# EAGLE schematic elements_v02 (EAGLE 5.09)

## Sheet 1 of 5
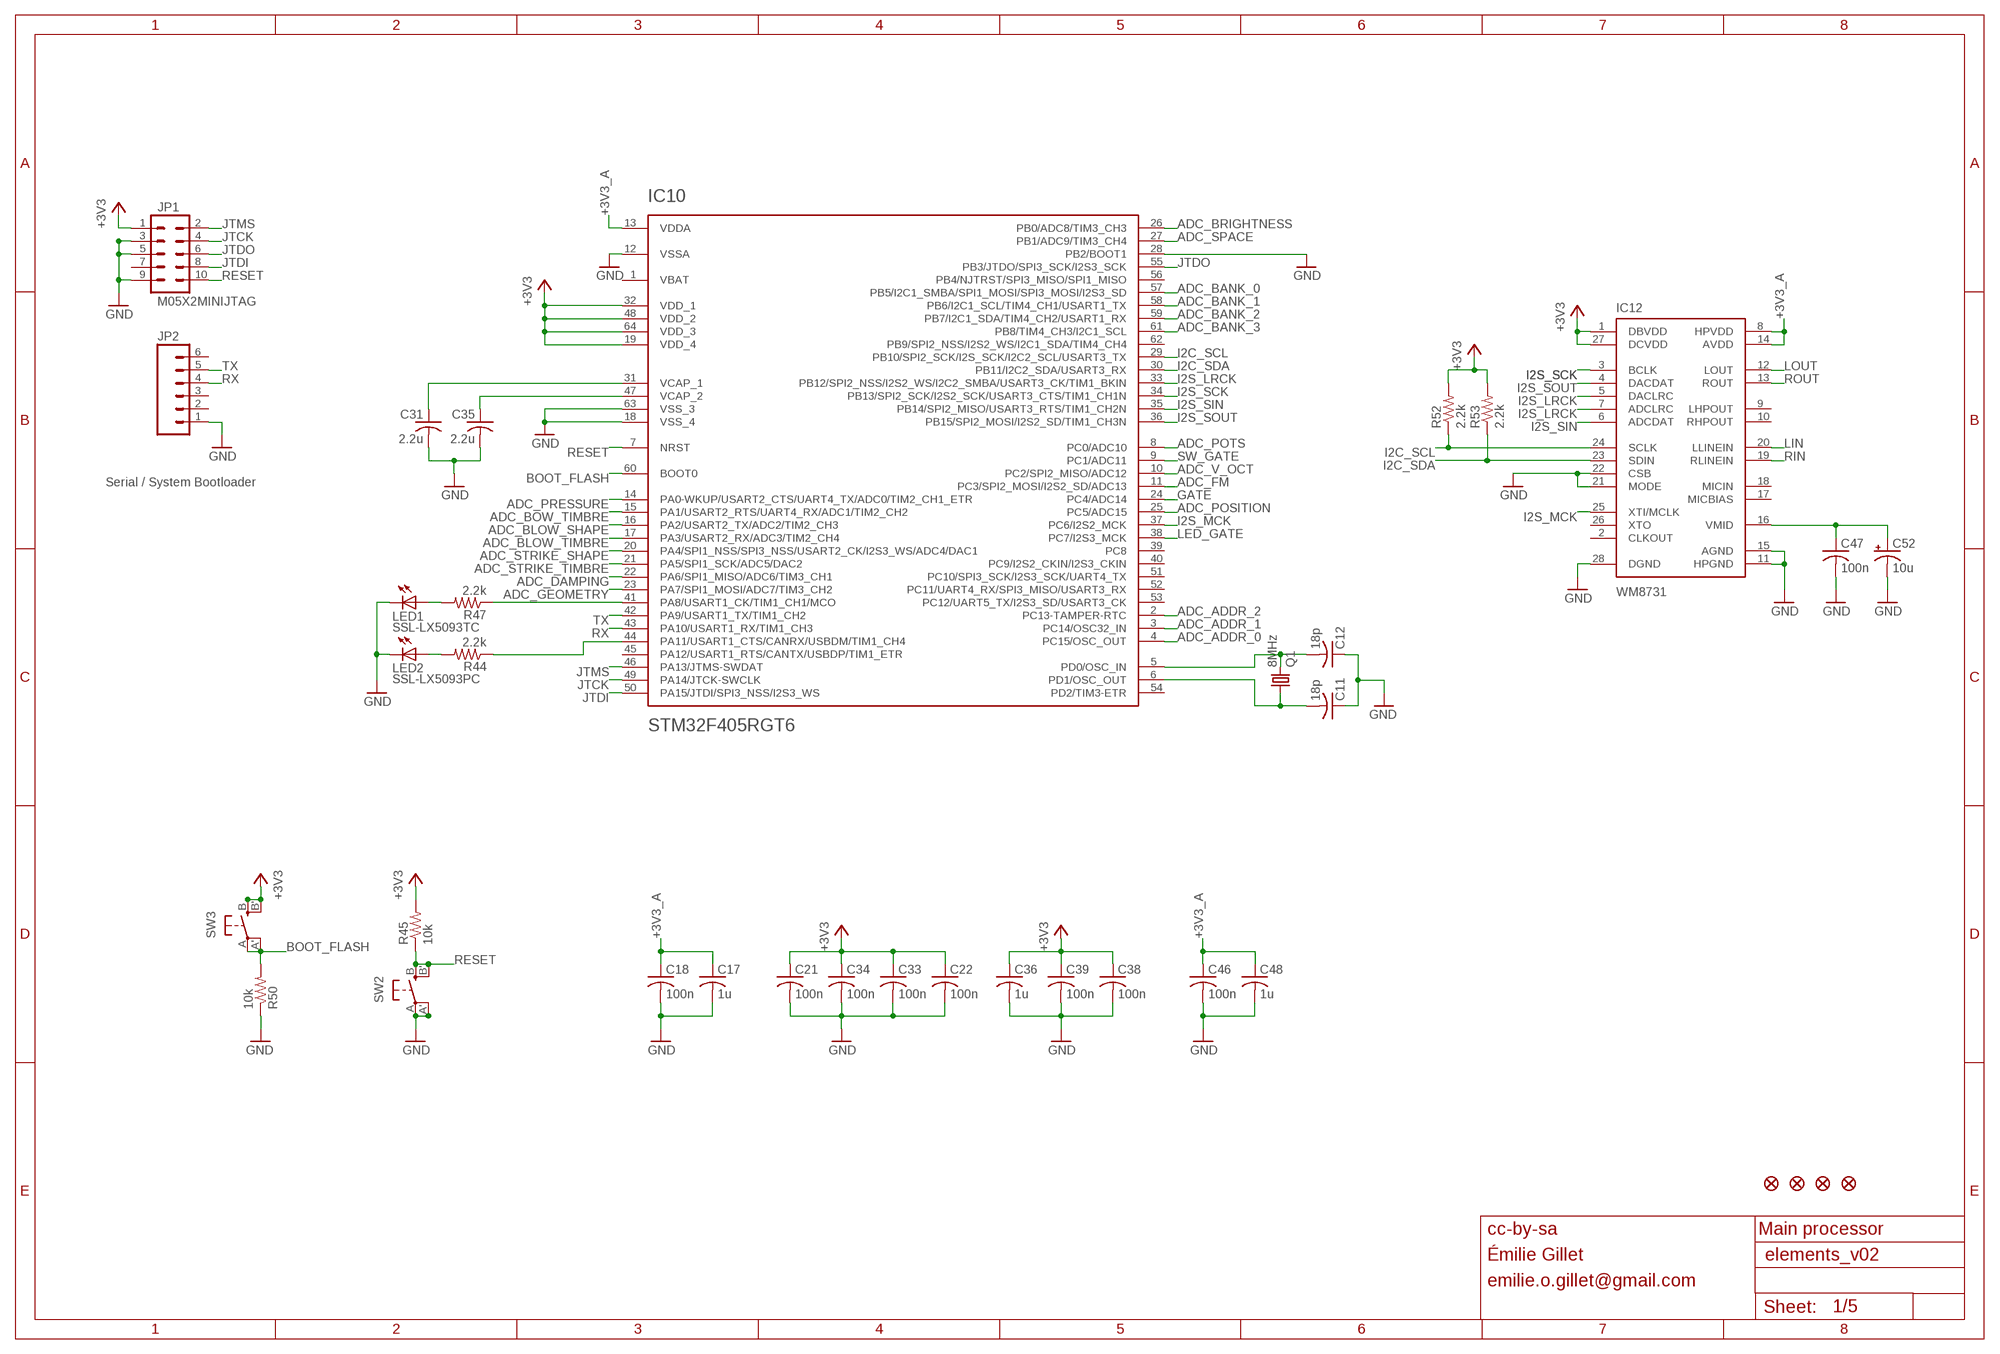
[diagram p0: schematic, sheet 1]

### Parts
C11  18p  C-USC0603  [C0603]
C12  18p  C-USC0603  [C0603]
C17  1u  C-USC0603  [C0603]
C18  100n  C-USC0603  [C0603]
C21  100n  C-USC0603  [C0603]
C22  100n  C-USC0603  [C0603]
C31  2.2u  C-USC0805  [C0805]
C33  100n  C-USC0603  [C0603]
C34  100n  C-USC0603  [C0603]
C35  2.2u  C-USC0805  [C0805]
C36  1u  C-USC0603  [C0603]
C38  100n  C-USC0603  [C0603]
C39  100n  C-USC0603  [C0603]
C46  100n  C-USC0603  [C0603]
C47  100n  C-USC0603  [C0603]
C48  1u  C-USC0603  [C0603]
C52  10u  CPOL-USB  [PANASONIC_B]
F1  FIDUCIAL1X2  [FIDUCIAL-1X2]
F2  FIDUCIAL1X2  [FIDUCIAL-1X2]
F3  FIDUCIAL1X2  [FIDUCIAL-1X2]
F4  FIDUCIAL1X2  [FIDUCIAL-1X2]
IC10  STM32F405RGT6  STM32F20X  [TQFP-10X10-64]
IC12  WM8731  [SSOP28]
JP1  M05X2MINIJTAG  [2X5-1.27]
JP2  M06SIP  [1X06]
LED1  SSL-LX5093TC  LED5MM  [LED5MM]
LED2  SSL-LX5093PC  LED5MM  [LED5MM]
Q1  8MHz  CRYSTALHC49UP  [HC49UP]
R44  2.2k  R-US_R0603  [R0603]
R45  10k  R-US_R0603  [R0603]
R47  2.2k  R-US_R0603  [R0603]
R50  10k  R-US_R0603  [R0603]
R52  2.2k  R-US_R0603  [R0603]
R53  2.2k  R-US_R0603  [R0603]
SW2  EVQQ2  [EVQ-Q2]
SW3  EVQQ2  [EVQ-Q2]

### Nets
+3V3: C21.1 C22.1 C33.1 C34.1 C36.1 C38.1 C39.1 IC10.19(VDD_4) IC10.32(VDD_1) IC10.48(VDD_2) IC10.64(VDD_3) IC12.1(DBVDD) IC12.27(DCVDD) JP1.1 R45.2 R52.2 R53.2 SW3.B'(S1) SW3.B(S) ; also sheet 5
+3V3_A: C17.1 C18.1 C46.1 C48.1 IC10.13(VDDA) IC12.8(HPVDD) IC12.14(AVDD) ; also sheet 3,4,5
ADC_ADDR_0: IC10.4(PC15/OSC_OUT) ; also sheet 4
ADC_ADDR_1: IC10.3(PC14/OSC32_IN) ; also sheet 4
ADC_ADDR_2: IC10.2(PC13-TAMPER-RTC) ; also sheet 4
ADC_BANK_0: IC10.57(PB5/I2C1_SMBA/SPI1_MOSI/SPI3_MOSI/I2S3_SD) ; also sheet 4
ADC_BANK_1: IC10.58(PB6/I2C1_SCL/TIM4_CH1/USART1_TX) ; also sheet 4
ADC_BANK_2: IC10.59(PB7/I2C1_SDA/TIM4_CH2/USART1_RX) ; also sheet 4
ADC_BANK_3: IC10.61(PB8/TIM4_CH3/I2C1_SCL) ; also sheet 4
ADC_BLOW_SHAPE: IC10.16(PA2/USART2_TX/ADC2/TIM2_CH3) ; also sheet 3
ADC_BLOW_TIMBRE: IC10.17(PA3/USART2_RX/ADC3/TIM2_CH4) ; also sheet 3
ADC_BOW_TIMBRE: IC10.15(PA1/USART2_RTS/UART4_RX/ADC1/TIM2_CH2) ; also sheet 3
ADC_BRIGHTNESS: IC10.26(PB0/ADC8/TIM3_CH3) ; also sheet 3
ADC_DAMPING: IC10.22(PA6/SPI1_MISO/ADC6/TIM3_CH1) ; also sheet 3
ADC_FM: IC10.11(PC3/SPI2_MOSI/I2S2_SD/ADC13) ; also sheet 3
ADC_GEOMETRY: IC10.23(PA7/SPI1_MOSI/ADC7/TIM3_CH2) ; also sheet 3
ADC_POSITION: IC10.25(PC5/ADC15) ; also sheet 3
ADC_POTS: IC10.8(PC0/ADC10) ; also sheet 4
ADC_PRESSURE: IC10.14(PA0-WKUP/USART2_CTS/UART4_TX/ADC0/TIM2_CH1_ETR) ; also sheet 3
ADC_SPACE: IC10.27(PB1/ADC9/TIM3_CH4) ; also sheet 3
ADC_STRIKE_SHAPE: IC10.20(PA4/SPI1_NSS/SPI3_NSS/USART2_CK/I2S3_WS/ADC4/DAC1) ; also sheet 3
ADC_STRIKE_TIMBRE: IC10.21(PA5/SPI1_SCK/ADC5/DAC2) ; also sheet 3
ADC_V_OCT: IC10.10(PC2/SPI2_MISO/ADC12) ; also sheet 3
BOOT_FLASH: IC10.60(BOOT0) R50.2 SW3.A'(P1) SW3.A(P)
GATE: IC10.24(PC4/ADC14) ; also sheet 4
GND: C11.1 C12.1 C17.2 C18.2 C21.2 C22.2 C31.2 C33.2 C34.2 C35.2 C36.2 C38.2 C39.2 C46.2 C47.2 C48.2 C52.- IC10.12(VSSA) IC10.18(VSS_4) IC10.28(PB2/BOOT1) IC10.63(VSS_3) IC12.11(HPGND) IC12.15(AGND) IC12.21(MODE) IC12.22(CSB) IC12.28(DGND) JP1.3 JP1.5 JP1.9 JP2.1 LED1.K(C) LED2.K(C) R50.1 SW2.A'(P1) SW2.A(P) ; also sheet 2,3,4,5
I2C_SCL: IC10.29(PB10/SPI2_SCK/I2S_SCK/I2C2_SCL/USART3_TX) IC12.24(SCLK) R52.1
I2C_SDA: IC10.30(PB11/I2C2_SDA/USART3_RX) IC12.23(SDIN) R53.1
I2S_LRCK: IC10.33(PB12/SPI2_NSS/I2S2_WS/I2C2_SMBA/USART3_CK/TIM1_BKIN) IC12.5(DACLRC) IC12.7(ADCLRC)
I2S_MCK: IC10.37(PC6/I2S2_MCK) IC12.25(XTI/MCLK)
I2S_SCK: IC10.34(PB13/SPI2_SCK/I2S2_SCK/USART3_CTS/TIM1_CH1N) IC12.3(BCLK)
I2S_SIN: IC10.35(PB14/SPI2_MISO/USART3_RTS/TIM1_CH2N) IC12.6(ADCDAT)
I2S_SOUT: IC10.36(PB15/SPI2_MOSI/I2S2_SD/TIM1_CH3N) IC12.4(DACDAT)
JTCK: IC10.49(PA14/JTCK-SWCLK) JP1.4
JTDI: IC10.50(PA15/JTDI/SPI3_NSS/I2S3_WS) JP1.8
JTDO: IC10.55(PB3/JTDO/SPI3_SCK/I2S3_SCK) JP1.6
JTMS: IC10.46(PA13/JTMS-SWDAT) JP1.2
LED_GATE: IC10.38(PC7/I2S3_MCK) ; also sheet 4
LIN: IC12.20(LLINEIN) ; also sheet 2
LOUT: IC12.12(LOUT) ; also sheet 2
N$7: C12.2 IC10.5(PD0/OSC_IN) Q1.2
N$8: C11.2 IC10.6(PD1/OSC_OUT) Q1.1
N$13: C35.1 IC10.47(VCAP_2)
N$17: C47.1 C52.+ IC12.16(VMID)
N$19: C31.1 IC10.31(VCAP_1)
N$54: IC10.44(PA11/USART1_CTS/CANRX/USBDM/TIM1_CH4) R44.1
N$59: LED2.A R44.2
N$60: LED1.A R47.2
N$79: IC10.41(PA8/USART1_CK/TIM1_CH1/MCO) R47.1
RESET: IC10.7(NRST) JP1.10 R45.1 SW2.B'(S1) SW2.B(S)
RIN: IC12.19(RLINEIN) ; also sheet 2
ROUT: IC12.13(ROUT) ; also sheet 2
RX: IC10.43(PA10/USART1_RX/TIM1_CH3) JP2.4
SW_GATE: IC10.9(PC1/ADC11) ; also sheet 4
TX: IC10.42(PA9/USART1_TX/TIM1_CH2) JP2.5
Unconnected: IC10.39(PC8) IC10.40(PC9/I2S2_CKIN/I2S3_CKIN) IC10.45(PA12/USART1_RTS/CANTX/USBDP/TIM1_ETR) IC10.51(PC10/SPI3_SCK/I2S3_SCK/UART4_TX) IC10.52(PC11/UART4_RX/SPI3_MISO/USART3_RX) IC10.53(PC12/UART5_TX/I2S3_SD/USART3_CK) IC10.54(PD2/TIM3-ETR) IC10.56(PB4/NJTRST/SPI3_MISO/SPI1_MISO) IC10.62(PB9/SPI2_NSS/I2S2_WS/I2C1_SDA/TIM4_CH4) IC12.2(CLKOUT) IC12.9(LHPOUT) IC12.10(RHPOUT) IC12.17(MICBIAS) IC12.18(MICIN) IC12.26(XTO) JP1.7 JP2.2 JP2.3 JP2.6

### Notes on the sheet
- Serial / System Bootloader
- cc-by-sa | Main processor
- Émilie Gillet
- emilie.o.gillet@gmail.com

## Sheet 2 of 5
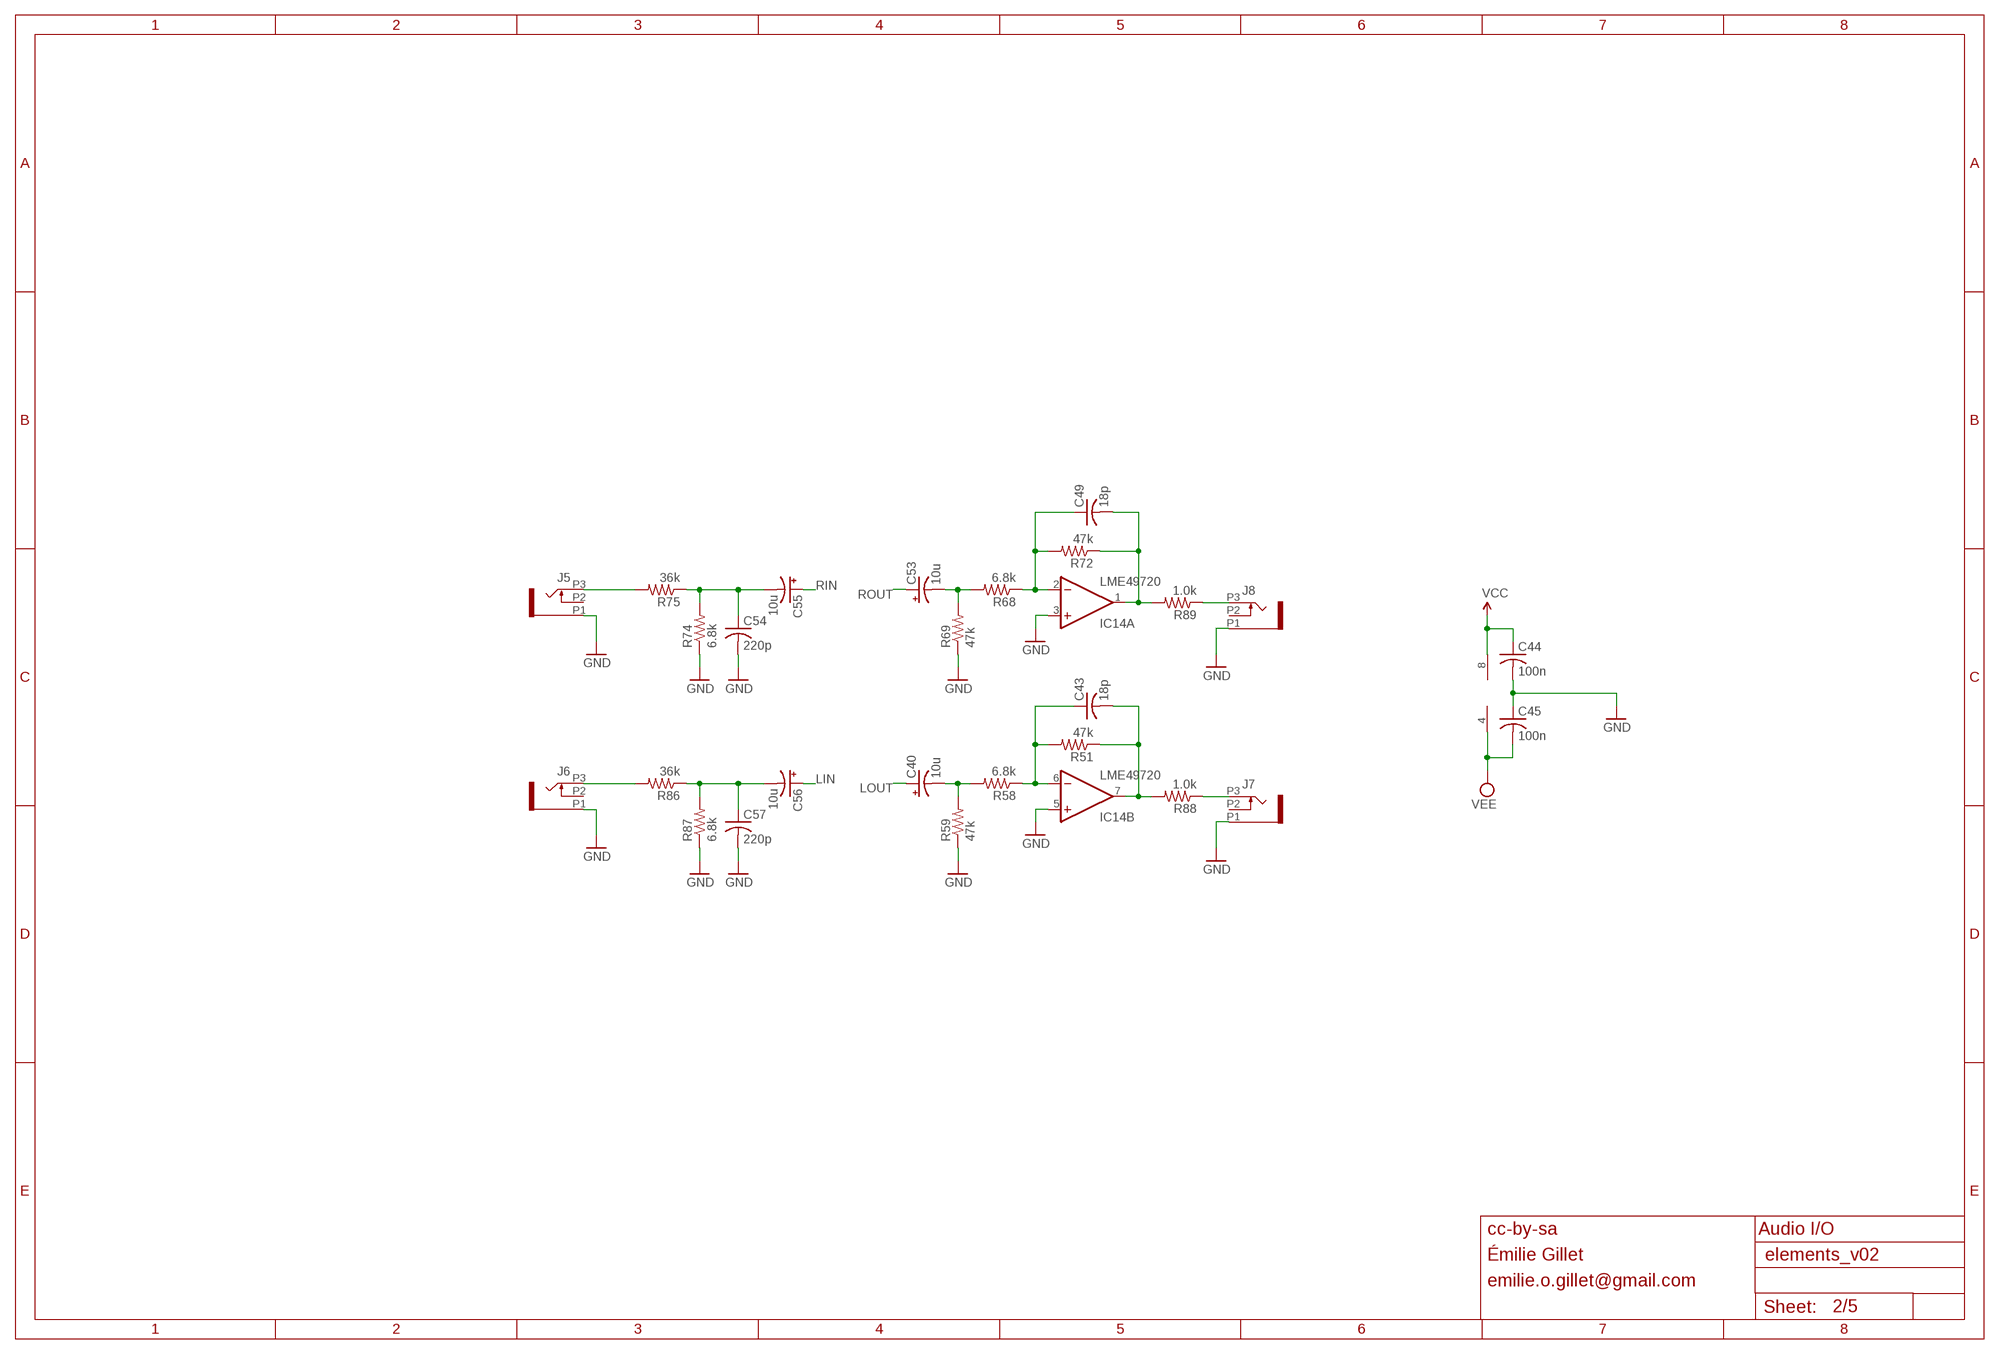
[diagram p1: schematic, sheet 2]

### Parts
C40  10u  CPOL-USB  [PANASONIC_B]
C43  18p  C-USC0603  [C0603]
C44  100n  C-USC0603  [C0603]
C45  100n  C-USC0603  [C0603]
C49  18p  C-USC0603  [C0603]
C53  10u  CPOL-USB  [PANASONIC_B]
C54  220p  C-USC0603  [C0603]
C55  10u  CPOL-USB  [PANASONIC_B]
C56  10u  CPOL-USB  [PANASONIC_B]
C57  220p  C-USC0603  [C0603]
IC14  LME49720  TL072D  [SO08]
J5  PJ301_THONKICONN6  [WQP_PJ_301M6]
J6  PJ301_THONKICONN6  [WQP_PJ_301M6]
J7  PJ301_THONKICONN6  [WQP_PJ_301M6]
J8  PJ301_THONKICONN6  [WQP_PJ_301M6]
R51  47k  R-US_R0603  [R0603]
R58  6.8k  R-US_R0603  [R0603]
R59  47k  R-US_R0603  [R0603]
R68  6.8k  R-US_R0603  [R0603]
R69  47k  R-US_R0603  [R0603]
R72  47k  R-US_R0603  [R0603]
R74  6.8k  R-US_R0603  [R0603]
R75  36k  R-US_R0603  [R0603]
R86  36k  R-US_R0603  [R0603]
R87  6.8k  R-US_R0603  [R0603]
R88  1.0k  R-US_R0603  [R0603]
R89  1.0k  R-US_R0603  [R0603]

### Nets
GND: C44.2 C45.1 C54.2 C57.2 IC14.3(A:+IN) IC14.5(B:+IN) J5.P1 J6.P1 J7.P1 J8.P1 R59.1 R69.1 R74.1 R87.1 ; also sheet 1,3,4,5
LIN: C56.+ ; also sheet 1
LOUT: C40.+ ; also sheet 1
LOUT_JACK: J8.P3 R89.1
N$18: C56.- C57.1 R86.1 R87.2
N$20: J5.P3 R75.2
N$21: J6.P3 R86.2
N$22: C54.1 C55.- R74.2 R75.1
N$23: C40.- R58.2 R59.2
N$25: C43.1 IC14.6(B:-IN) R51.2 R58.1
N$28: C43.2 IC14.7(B:OUT) R51.1 R88.2
N$31: C53.- R68.2 R69.2
N$32: C49.1 IC14.2(A:-IN) R68.1 R72.2
N$33: C49.2 IC14.1(A:OUT) R72.1 R89.2
RIN: C55.+ ; also sheet 1
ROUT: C53.+ ; also sheet 1
ROUT_JACK: J7.P3 R88.1
VCC: C44.1 IC14.8(P:V+) ; also sheet 5
VEE: C45.2 IC14.4(P:V-) ; also sheet 5
Unconnected: J5.P2 J6.P2 J7.P2 J8.P2

### Notes on the sheet
- cc-by-sa | Audio I/O
- Émilie Gillet
- emilie.o.gillet@gmail.com

## Sheet 3 of 5
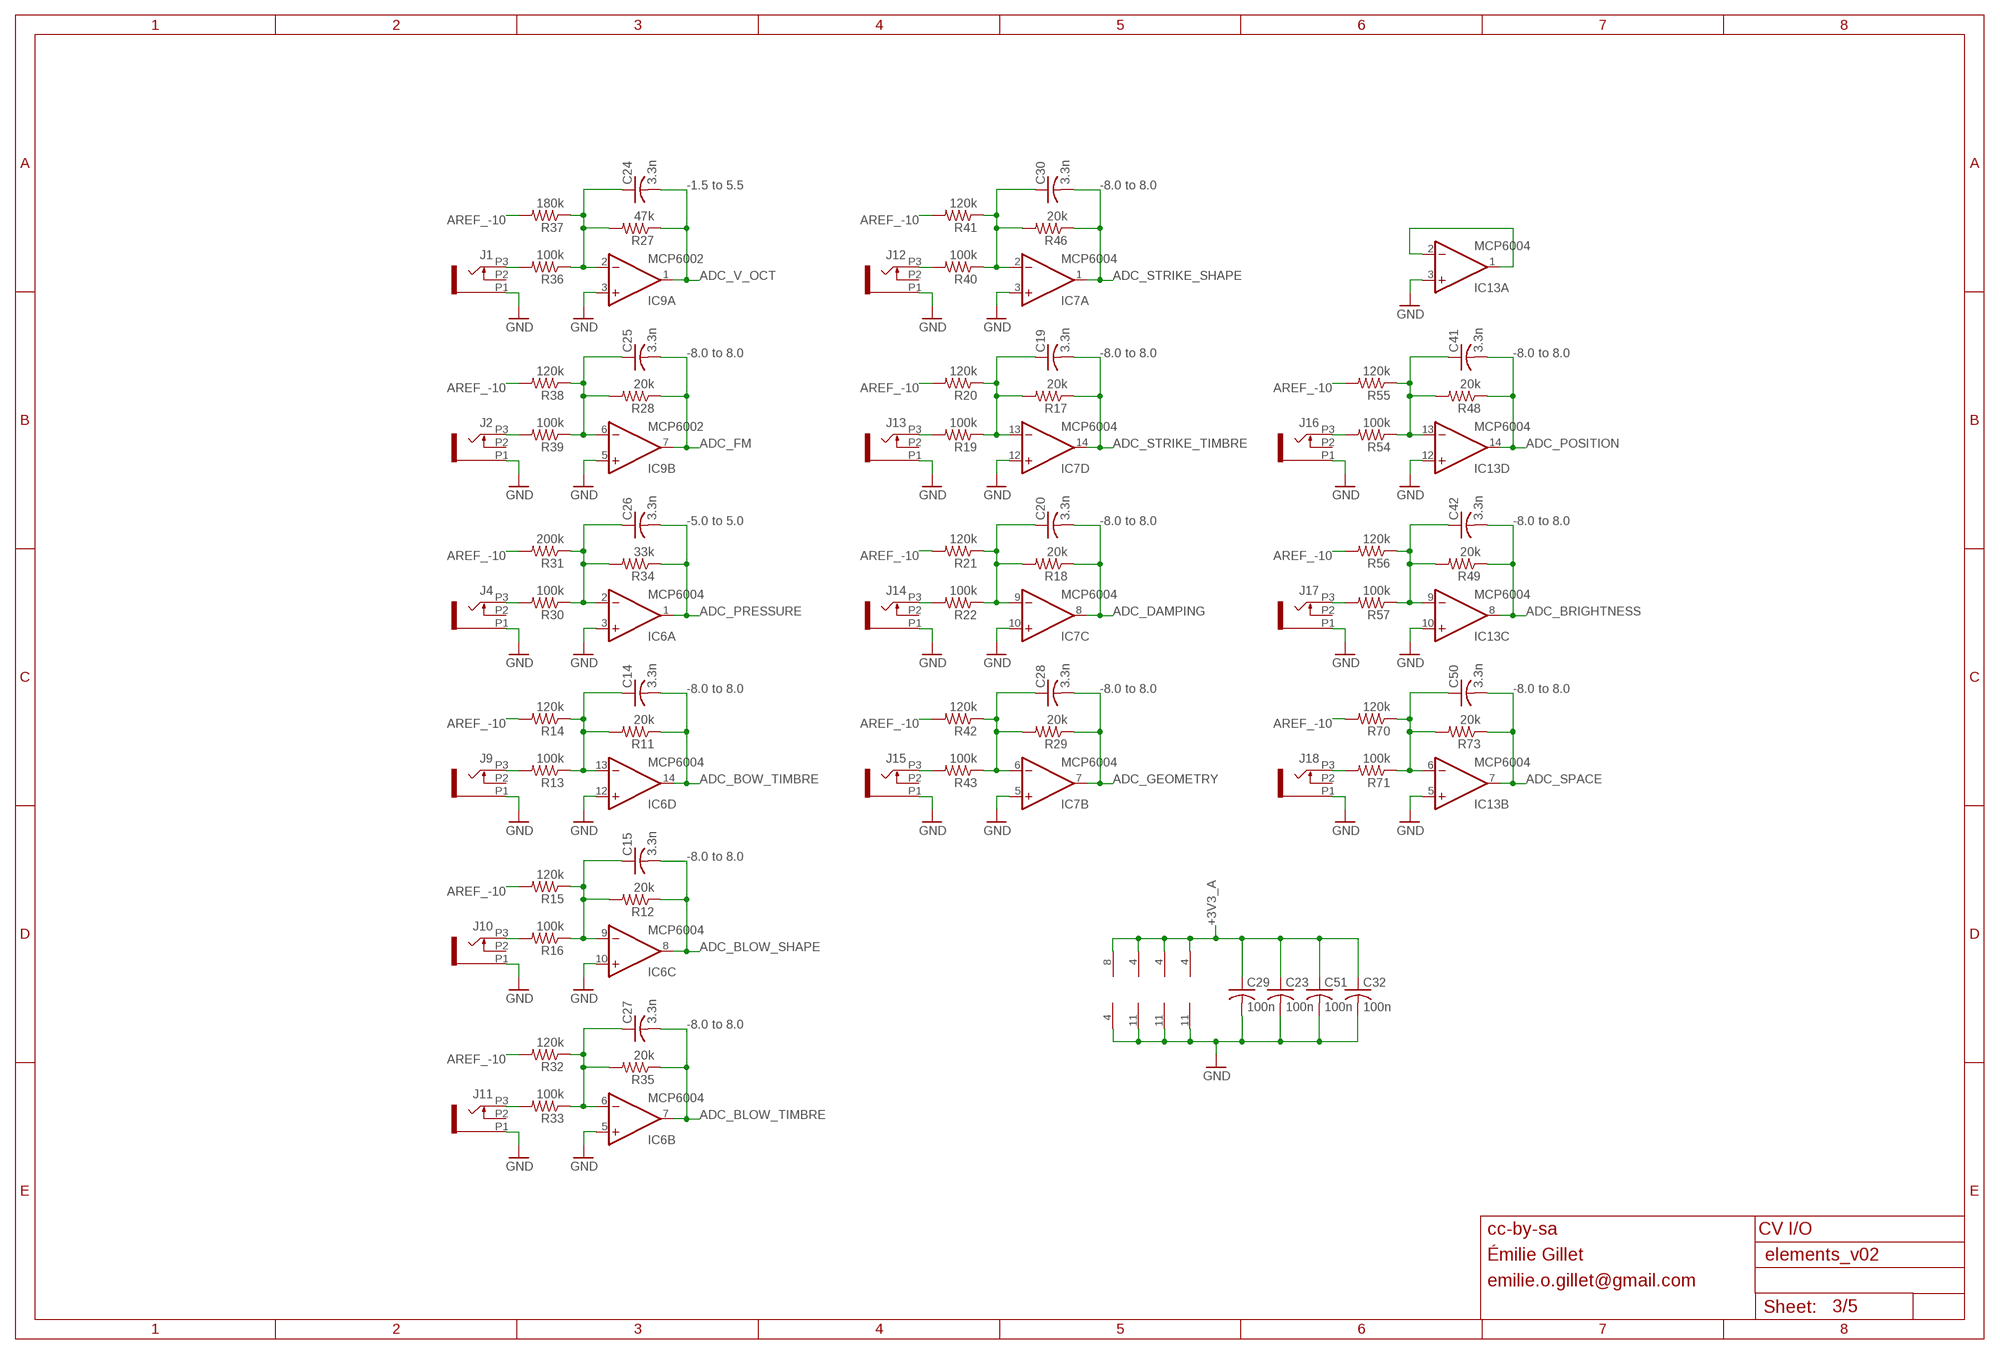
[diagram p2: schematic, sheet 3]

### Parts
C14  3.3n  C-USC0603  [C0603]
C15  3.3n  C-USC0603  [C0603]
C19  3.3n  C-USC0603  [C0603]
C20  3.3n  C-USC0603  [C0603]
C23  100n  C-USC0603  [C0603]
C24  3.3n  C-USC0603  [C0603]
C25  3.3n  C-USC0603  [C0603]
C26  3.3n  C-USC0603  [C0603]
C27  3.3n  C-USC0603  [C0603]
C28  3.3n  C-USC0603  [C0603]
C29  100n  C-USC0603  [C0603]
C30  3.3n  C-USC0603  [C0603]
C32  100n  C-USC0603  [C0603]
C41  3.3n  C-USC0603  [C0603]
C42  3.3n  C-USC0603  [C0603]
C50  3.3n  C-USC0603  [C0603]
C51  100n  C-USC0603  [C0603]
IC6  MCP6004  TL074D  [SO14]
IC7  MCP6004  TL074D  [SO14]
IC9  MCP6002  TL072D  [SO08]
IC13  MCP6004  TL074D  [SO14]
J1  PJ301_THONKICONN6  [WQP_PJ_301M6]
J2  PJ301_THONKICONN6  [WQP_PJ_301M6]
J4  PJ301_THONKICONN6  [WQP_PJ_301M6]
J9  PJ301_THONKICONN6  [WQP_PJ_301M6]
J10  PJ301_THONKICONN6  [WQP_PJ_301M6]
J11  PJ301_THONKICONN6  [WQP_PJ_301M6]
J12  PJ301_THONKICONN6  [WQP_PJ_301M6]
J13  PJ301_THONKICONN6  [WQP_PJ_301M6]
J14  PJ301_THONKICONN6  [WQP_PJ_301M6]
J15  PJ301_THONKICONN6  [WQP_PJ_301M6]
J16  PJ301_THONKICONN6  [WQP_PJ_301M6]
J17  PJ301_THONKICONN6  [WQP_PJ_301M6]
J18  PJ301_THONKICONN6  [WQP_PJ_301M6]
R11  20k  R-US_R0603  [R0603]
R12  20k  R-US_R0603  [R0603]
R13  100k  R-US_R0603  [R0603]
R14  120k  R-US_R0603  [R0603]
R15  120k  R-US_R0603  [R0603]
R16  100k  R-US_R0603  [R0603]
R17  20k  R-US_R0603  [R0603]
R18  20k  R-US_R0603  [R0603]
R19  100k  R-US_R0603  [R0603]
R20  120k  R-US_R0603  [R0603]
R21  120k  R-US_R0603  [R0603]
R22  100k  R-US_R0603  [R0603]
R27  47k  R-US_R0603  [R0603]
R28  20k  R-US_R0603  [R0603]
R29  20k  R-US_R0603  [R0603]
R30  100k  R-US_R0603  [R0603]
R31  200k  R-US_R0603  [R0603]
R32  120k  R-US_R0603  [R0603]
R33  100k  R-US_R0603  [R0603]
R34  33k  R-US_R0603  [R0603]
R35  20k  R-US_R0603  [R0603]
R36  100k  R-US_R0603  [R0603]
R37  180k  R-US_R0603  [R0603]
R38  120k  R-US_R0603  [R0603]
R39  100k  R-US_R0603  [R0603]
R40  100k  R-US_R0603  [R0603]
R41  120k  R-US_R0603  [R0603]
R42  120k  R-US_R0603  [R0603]
R43  100k  R-US_R0603  [R0603]
R46  20k  R-US_R0603  [R0603]
R48  20k  R-US_R0603  [R0603]
R49  20k  R-US_R0603  [R0603]
R54  100k  R-US_R0603  [R0603]
R55  120k  R-US_R0603  [R0603]
R56  120k  R-US_R0603  [R0603]
R57  100k  R-US_R0603  [R0603]
R70  120k  R-US_R0603  [R0603]
R71  100k  R-US_R0603  [R0603]
R73  20k  R-US_R0603  [R0603]

### Nets
+3V3_A: C23.1 C29.1 C32.1 C51.1 IC6.4(P:V+) IC7.4(P:V+) IC9.8(P:V+) IC13.4(P:V+) ; also sheet 1,4,5
ADC_BLOW_SHAPE: C15.2 IC6.8(C:OUT) R12.1 ; also sheet 1
ADC_BLOW_TIMBRE: C27.2 IC6.7(B:OUT) R35.1 ; also sheet 1
ADC_BOW_TIMBRE: C14.2 IC6.14(D:OUT) R11.1 ; also sheet 1
ADC_BRIGHTNESS: C42.2 IC13.8(C:OUT) R49.1 ; also sheet 1
ADC_DAMPING: C20.2 IC7.8(C:OUT) R18.1 ; also sheet 1
ADC_FM: C25.2 IC9.7(B:OUT) R28.1 ; also sheet 1
ADC_GEOMETRY: C28.2 IC7.7(B:OUT) R29.1 ; also sheet 1
ADC_POSITION: C41.2 IC13.14(D:OUT) R48.1 ; also sheet 1
ADC_PRESSURE: C26.2 IC6.1(A:OUT) R34.1 ; also sheet 1
ADC_SPACE: C50.2 IC13.7(B:OUT) R73.1 ; also sheet 1
ADC_STRIKE_SHAPE: C30.2 IC7.1(A:OUT) R46.1 ; also sheet 1
ADC_STRIKE_TIMBRE: C19.2 IC7.14(D:OUT) R17.1 ; also sheet 1
ADC_V_OCT: C24.2 IC9.1(A:OUT) R27.1 ; also sheet 1
AREF_-10: R14.2 R15.2 R20.2 R21.2 R31.2 R32.2 R37.2 R38.2 R41.2 R42.2 R55.2 R56.2 R70.2 ; also sheet 5
GND: C23.2 C29.2 C32.2 C51.2 IC6.3(A:+IN) IC6.5(B:+IN) IC6.10(C:+IN) IC6.11(P:V-) IC6.12(D:+IN) IC7.3(A:+IN) IC7.5(B:+IN) IC7.10(C:+IN) IC7.11(P:V-) IC7.12(D:+IN) IC9.3(A:+IN) IC9.4(P:V-) IC9.5(B:+IN) IC13.3(A:+IN) IC13.5(B:+IN) IC13.10(C:+IN) IC13.11(P:V-) IC13.12(D:+IN) J1.P1 J2.P1 J4.P1 J9.P1 J10.P1 J11.P1 J12.P1 J13.P1 J14.P1 J15.P1 J16.P1 J17.P1 J18.P1 ; also sheet 1,2,4,5
N$1: J10.P3 R16.2
N$2: C15.1 IC6.9(C:-IN) R12.2 R15.1 R16.1
N$3: J13.P3 R19.2
N$4: J9.P3 R13.2
N$5: C14.1 IC6.13(D:-IN) R11.2 R13.1 R14.1
N$6: J2.P3 R39.2
N$9: C19.1 IC7.13(D:-IN) R17.2 R19.1 R20.1
N$10: J1.P3 R36.2
N$11: C24.1 IC9.2(A:-IN) R27.2 R36.1 R37.1
N$12: J14.P3 R22.2
N$14: C20.1 IC7.9(C:-IN) R18.2 R21.1 R22.1
N$15: C25.1 IC9.6(B:-IN) R28.2 R38.1 R39.1
N$16: J12.P3 R40.2
N$24: C30.1 IC7.2(A:-IN) R40.1 R41.1 R46.2
N$26: J11.P3 R33.2
N$27: C27.1 IC6.6(B:-IN) R32.1 R33.1 R35.2
N$29: J17.P3 R57.2
N$30: C42.1 IC13.9(C:-IN) R49.2 R56.1 R57.1
N$34: J18.P3 R71.2
N$35: C50.1 IC13.6(B:-IN) R70.1 R71.1 R73.2
N$36: J15.P3 R43.2
N$37: C28.1 IC7.6(B:-IN) R29.2 R42.1 R43.1
N$39: J16.P3 R54.2
N$40: C41.1 IC13.13(D:-IN) R48.2 R54.1 R55.1
N$41: J4.P3 R30.2
N$42: C26.1 IC6.2(A:-IN) R30.1 R31.1 R34.2
N$44: IC13.1(A:OUT) IC13.2(A:-IN)
Unconnected: J1.P2 J2.P2 J4.P2 J9.P2 J10.P2 J11.P2 J12.P2 J13.P2 J14.P2 J15.P2 J16.P2 J17.P2 J18.P2

### Notes on the sheet
- -1.5 to 5.5 | -8.0 to 8.0
- -8.0 to 8.0 | -8.0 to 8.0 | -8.0 to 8.0
- -5.0 to 5.0 | -8.0 to 8.0 | -8.0 to 8.0
- -8.0 to 8.0 | -8.0 to 8.0 | -8.0 to 8.0
- -8.0 to 8.0
- -8.0 to 8.0
- cc-by-sa | CV I/O
- Émilie Gillet
- emilie.o.gillet@gmail.com

## Sheet 4 of 5
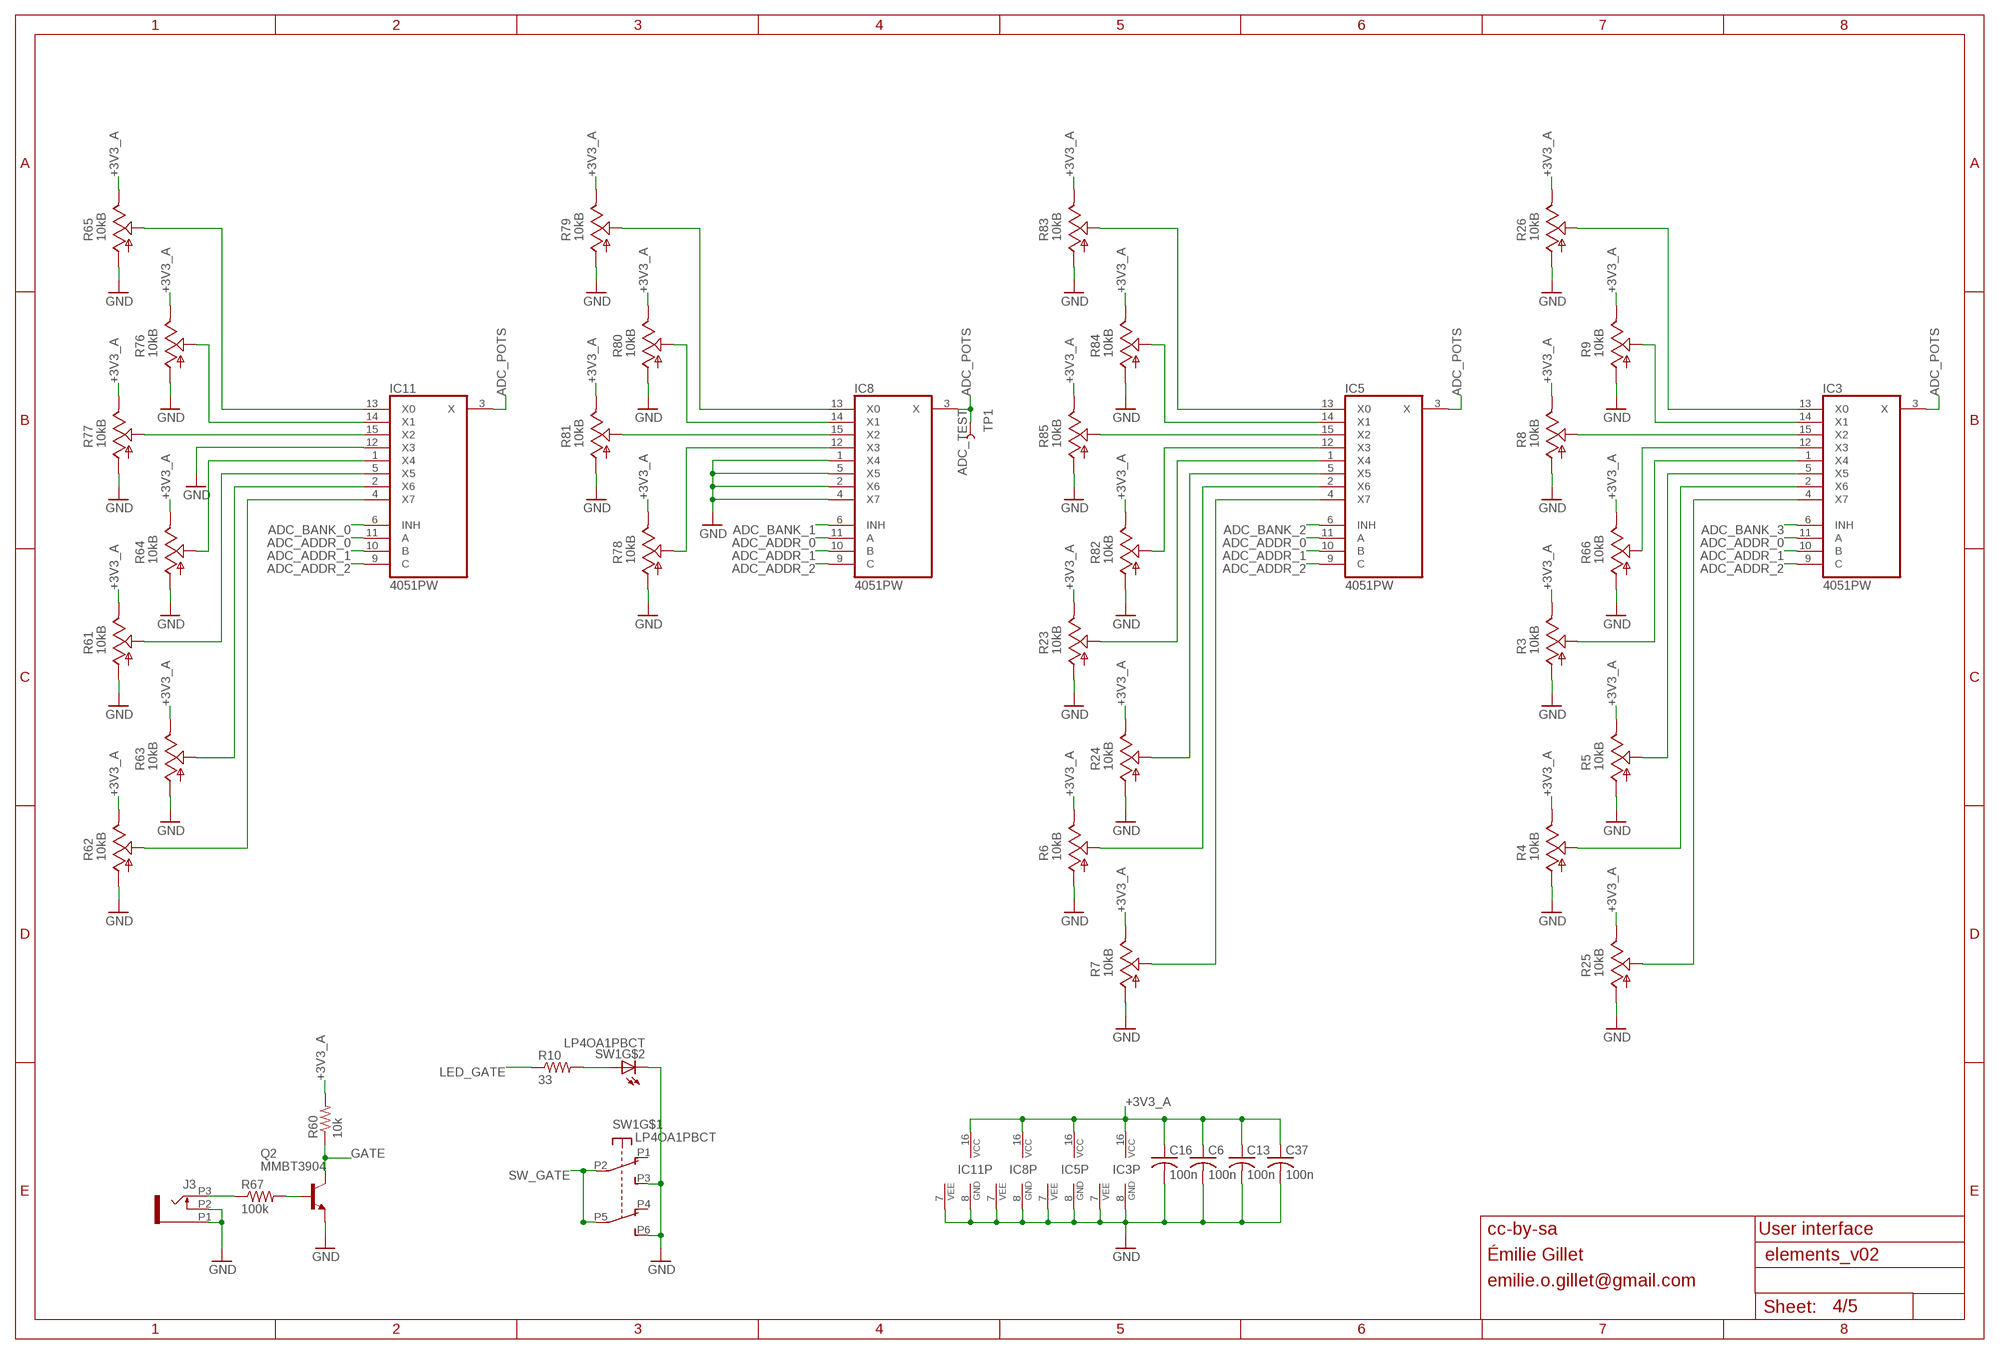
[diagram p3: schematic, sheet 4]

### Parts
C6  100n  C-USC0603  [C0603]
C13  100n  C-USC0603  [C0603]
C16  100n  C-USC0603  [C0603]
C37  100n  C-USC0603  [C0603]
IC3  4051PW  [TSSOP16]
IC5  4051PW  [TSSOP16]
IC8  4051PW  [TSSOP16]
IC11  4051PW  [TSSOP16]
J3  PJ301_THONKICONN6  [WQP_PJ_301M6]
Q2  MMBT3904  MMBT3904LT1-NPN-SOT23-BEC  [SOT23-BEC]
R3  10kB  POT_USVERTICAL_PS  [ALPS_POT_VERTICAL_PS]
R4  10kB  POT_USVERTICAL_PS  [ALPS_POT_VERTICAL_PS]
R5  10kB  POT_USVERTICAL_PS  [ALPS_POT_VERTICAL_PS]
R6  10kB  POT_USVERTICAL_PS  [ALPS_POT_VERTICAL_PS]
R7  10kB  POT_USVERTICAL_PS  [ALPS_POT_VERTICAL_PS]
R8  10kB  POT_USVERTICAL_PS  [ALPS_POT_VERTICAL_PS]
R9  10kB  POT_USVERTICAL_PS  [ALPS_POT_VERTICAL_PS]
R10  33  R-US_R0603  [R0603]
R23  10kB  POT_USVERTICAL_PS  [ALPS_POT_VERTICAL_PS]
R24  10kB  POT_USVERTICAL_PS  [ALPS_POT_VERTICAL_PS]
R25  10kB  POT_USVERTICAL_PS  [ALPS_POT_VERTICAL_PS]
R26  10kB  POT_USVERTICAL_PS  [ALPS_POT_VERTICAL_PS]
R60  10k  R-US_R0603  [R0603]
R61  10kB  POT_USVERTICAL_PS  [ALPS_POT_VERTICAL_PS]
R62  10kB  POT_USVERTICAL_PS  [ALPS_POT_VERTICAL_PS]
R63  10kB  POT_USVERTICAL_PS  [ALPS_POT_VERTICAL_PS]
R64  10kB  POT_USVERTICAL_PS  [ALPS_POT_VERTICAL_PS]
R65  10kB  POT_USVERTICAL_PS  [ALPS_POT_VERTICAL_PS]
R66  10kB  POT_USVERTICAL_PS  [ALPS_POT_VERTICAL_PS]
R67  100k  R-US_R0603  [R0603]
R76  10kB  POT_USVERTICAL  [ALPS_POT_VERTICAL]
R77  10kB  POT_USVERTICAL  [ALPS_POT_VERTICAL]
R78  10kB  POT_USVERTICAL  [ALPS_POT_VERTICAL]
R79  10kB  POT_USVERTICAL  [ALPS_POT_VERTICAL]
R80  10kB  POT_USVERTICAL  [ALPS_POT_VERTICAL]
R81  10kB  POT_USVERTICAL  [ALPS_POT_VERTICAL]
R82  10kB  POT_USVERTICAL  [ALPS_POT_VERTICAL]
R83  10kB  POT_USVERTICAL  [ALPS_POT_VERTICAL]
R84  10kB  POT_USVERTICAL  [ALPS_POT_VERTICAL]
R85  10kB  POT_USVERTICAL  [ALPS_POT_VERTICAL]
SW1  LP4OA1PBCT  [LP4OA1PBCT]
TP1  ADC_TEST  TEST-POINT3  [PAD.03X.03]

### Nets
+3V3_A: C6.1 C13.1 C16.1 C37.1 IC3.16(VCC) IC5.16(VCC) IC8.16(VCC) IC11.16(VCC) R3.P$1(E) R4.P$1(E) R5.P$1(E) R6.P$1(E) R7.P$1(E) R8.P$1(E) R9.P$1(E) R23.P$1(E) R24.P$1(E) R25.P$1(E) R26.P$1(E) R60.2 R61.P$1(E) R62.P$1(E) R63.P$1(E) R64.P$1(E) R65.P$1(E) R66.P$1(E) R76.P$1(E) R77.P$1(E) R78.P$1(E) R79.P$1(E) R80.P$1(E) R81.P$1(E) R82.P$1(E) R83.P$1(E) R84.P$1(E) R85.P$1(E) ; also sheet 1,3,5
ADC_ADDR_0: IC3.11(A) IC5.11(A) IC8.11(A) IC11.11(A) ; also sheet 1
ADC_ADDR_1: IC3.10(B) IC5.10(B) IC8.10(B) IC11.10(B) ; also sheet 1
ADC_ADDR_2: IC3.9(C) IC5.9(C) IC8.9(C) IC11.9(C) ; also sheet 1
ADC_BANK_0: IC11.6(INH) ; also sheet 1
ADC_BANK_1: IC8.6(INH) ; also sheet 1
ADC_BANK_2: IC5.6(INH) ; also sheet 1
ADC_BANK_3: IC3.6(INH) ; also sheet 1
ADC_POTS: IC3.3(X) IC5.3(X) IC8.3(X) IC11.3(X) TP1.P$1 ; also sheet 1
GATE: Q2.C R60.1 ; also sheet 1
GND: C6.2 C13.2 C16.2 C37.2 IC3.7(VEE) IC3.8(GND) IC5.7(VEE) IC5.8(GND) IC8.1(X4) IC8.2(X6) IC8.4(X7) IC8.5(X5) IC8.7(VEE) IC8.8(GND) IC11.7(VEE) IC11.8(GND) IC11.12(X3) J3.P1 J3.P2 Q2.E R3.P$3(A) R4.P$3(A) R5.P$3(A) R6.P$3(A) R7.P$3(A) R8.P$3(A) R9.P$3(A) R23.P$3(A) R24.P$3(A) R25.P$3(A) R26.P$3(A) R61.P$3(A) R62.P$3(A) R63.P$3(A) R64.P$3(A) R65.P$3(A) R66.P$3(A) R76.P$3(A) R77.P$3(A) R78.P$3(A) R79.P$3(A) R80.P$3(A) R81.P$3(A) R82.P$3(A) R83.P$3(A) R84.P$3(A) R85.P$3(A) SW1.L2 SW1.P3(A3) SW1.P6(B3) ; also sheet 1,2,3,5
LED_GATE: R10.1 ; also sheet 1
N$38: R10.2 SW1.L1
N$43: J3.P3 R67.1
N$45: IC11.14(X1) R76.P$2(S)
N$46: IC11.13(X0) R65.P$2(S)
N$47: IC11.15(X2) R77.P$2(S)
N$48: IC11.1(X4) R64.P$2(S)
N$49: IC11.5(X5) R61.P$2(S)
N$50: IC8.14(X1) R80.P$2(S)
N$51: IC8.12(X3) R78.P$2(S)
N$52: IC11.2(X6) R63.P$2(S)
N$53: IC11.4(X7) R62.P$2(S)
N$55: IC3.12(X3) R66.P$2(S)
N$57: IC8.15(X2) R81.P$2(S)
N$58: IC8.13(X0) R79.P$2(S)
N$62: IC3.13(X0) R26.P$2(S)
N$63: IC3.15(X2) R8.P$2(S)
N$65: IC5.12(X3) R82.P$2(S)
N$66: Q2.B R67.2
N$67: IC5.4(X7) R7.P$2(S)
N$68: IC3.14(X1) R9.P$2(S)
N$69: IC5.2(X6) R6.P$2(S)
N$70: IC5.5(X5) R24.P$2(S)
N$71: IC5.1(X4) R23.P$2(S)
N$72: IC3.4(X7) R25.P$2(S)
N$73: IC3.2(X6) R4.P$2(S)
N$74: IC3.1(X4) R3.P$2(S)
N$75: IC3.5(X5) R5.P$2(S)
N$76: IC5.13(X0) R83.P$2(S)
N$77: IC5.14(X1) R84.P$2(S)
N$78: IC5.15(X2) R85.P$2(S)
SW_GATE: SW1.P2(A2) SW1.P5(B2) ; also sheet 1
Unconnected: SW1.P1(A1) SW1.P4(B1)

### Notes on the sheet
- cc-by-sa | User interface
- Émilie Gillet
- emilie.o.gillet@gmail.com

## Sheet 5 of 5
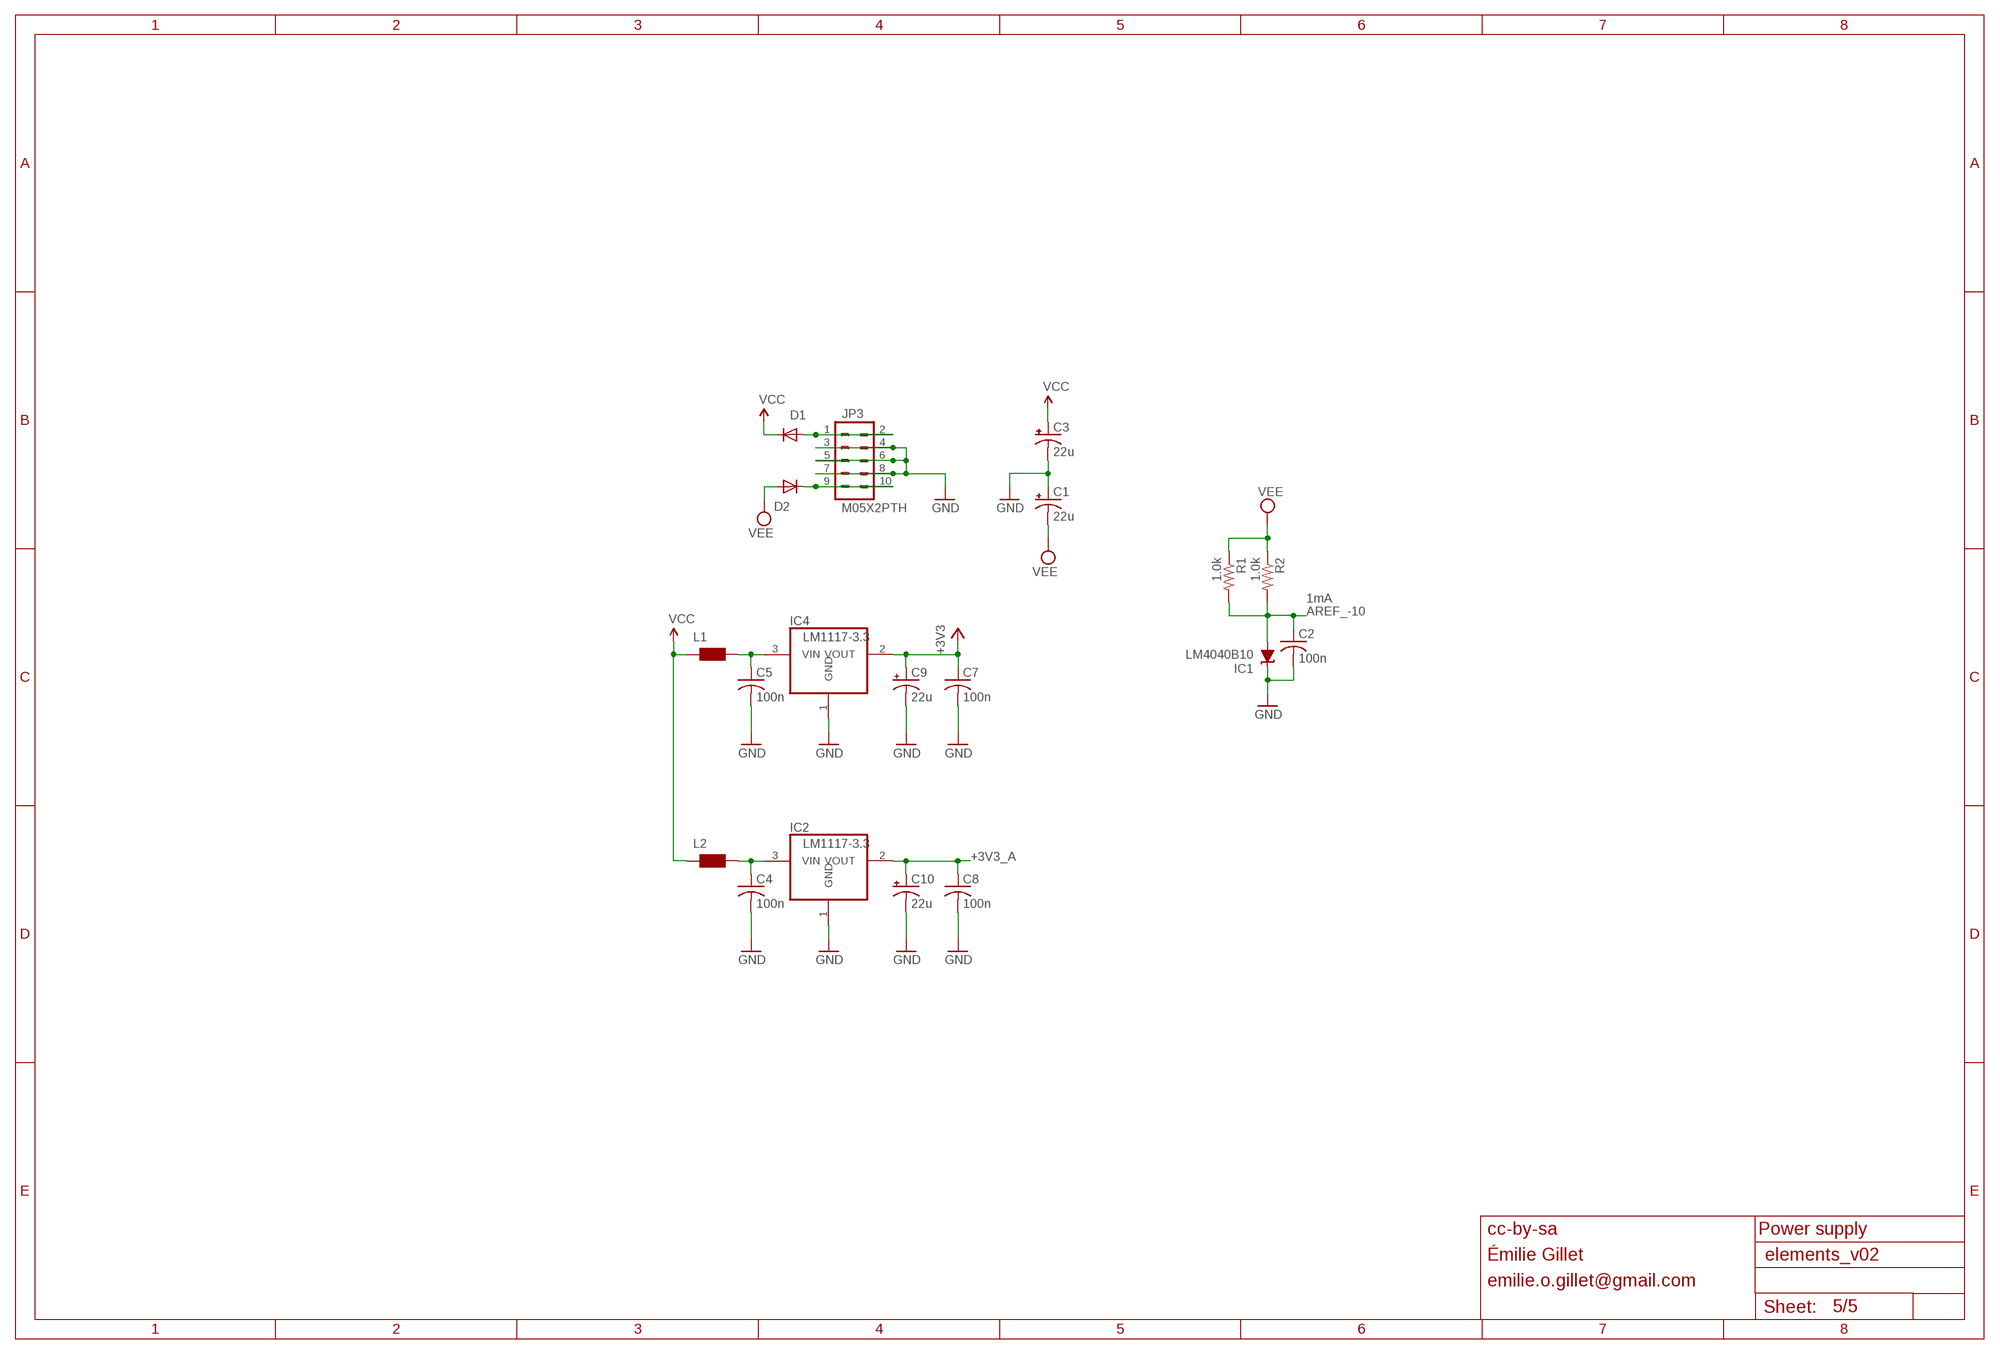
[diagram p4: schematic, sheet 5]

### Parts
C1  22u  CPOL-USC  [PANASONIC_C]
C2  100n  C-USC0603  [C0603]
C3  22u  CPOL-USC  [PANASONIC_C]
C4  100n  C-USC0603  [C0603]
C5  100n  C-USC0603  [C0603]
C7  100n  C-USC0603  [C0603]
C8  100n  C-USC0603  [C0603]
C9  22u  CPOL-USC  [PANASONIC_C]
C10  22u  CPOL-USC  [PANASONIC_C]
D1  1N5819HW  DIODE-SOD123  [SOD123]
D2  1N5819HW  DIODE-SOD123  [SOD123]
IC1  LM4040B10  LM4041B12DBZ  [DBZ_R-PDSO-G3]
IC2  LM1117-3.3  REG1117  [SOT223]
IC4  LM1117-3.3  REG1117  [SOT223]
JP3  M05X2PTH  [AVR_ICSP]
L1  WE-CBF_0603  [0603]
L2  WE-CBF_0603  [0603]
R1  1.0k  R-US_R0603  [R0603]
R2  1.0k  R-US_R0603  [R0603]

### Nets
+3V3: C7.1 C9.+ IC4.2(VOUT) ; also sheet 1
+3V3_A: C8.1 C10.+ IC2.2(VOUT) ; also sheet 1,3,4
AREF_-10: C2.1 IC1.2(A) R1.2 R2.2 ; also sheet 3
GND: C1.+ C2.2 C3.- C4.2 C5.2 C7.2 C8.2 C9.- C10.- IC1.1(C) IC2.1(GND) IC4.1(GND) JP3.3 JP3.4 JP3.5 JP3.6 JP3.7 JP3.8 ; also sheet 1,2,3,4
N$56: D1.A JP3.1 JP3.2
N$61: C5.1 IC4.3(VIN) L1.2
N$64: D2.C JP3.9 JP3.10
N$80: C4.1 IC2.3(VIN) L2.2
VCC: C3.+ D1.C L1.1 L2.1 ; also sheet 2
VEE: C1.- D2.A R1.1 R2.1 ; also sheet 2

### Notes on the sheet
- 1mA
- cc-by-sa | Power supply
- Émilie Gillet
- emilie.o.gillet@gmail.com

## Power pins joined to a net without a drawn wire
VBAT: IC10.1(VBAT)

## Library data of the parts
C1 C3 C9 C10 C40 C52 C53 C55 C56 = rcl:CPOL-US: POLARIZED CAPACITOR, American symbol
C2 C4-C8 C11-C39 C41-C51 C54 C57 = rcl:C-US: CAPACITOR, American symbol
D1 D2 = diode:DIODE-: DIODE
F1-F4 = SparkFun:FIDUCIAL: Fiducial Alignment Points Various fiducial points for machine vision alignment.
IC1 = texas:LM4041: PRECISION MICROPOWER SHUNT VOLTAGE REFERENCE Source: http://focus.ti.com/lit/ds/slcs146e/slcs146e.pdf
IC2 IC4 = og-vreg:REG1117: 800mA and 1A Low Dropout (LDO) Positive Regulator 1.8V, 2.5V, 2.85V, 3.3V, 5V, and Adj
IC3 IC5 IC8 IC11 = og-ics:4051: 8-channel ANALOG MULTIPLEXER
IC6 IC7 IC13 = gm-ics:TL074: OP AMP
IC9 = gm-ics:TL072: OP AMP
IC10 = og-stm32f2:STM32F20X
IC12 = og-dac:WM8731
IC14 = og-linear:TL072: OP AMP
J1-J18 = og-pj301:PJ301_THONKICONN
JP1 JP3 = og-header:M05X2: Header 5x2 Standard 10-pin dual row 0.1" header. Commonly used with AVR-ISP. Use with Spark Fun Electronics SKU: PRT-00778
JP2 = SparkFun:M06: Header 6 Standard 6-pin 0.1" header. Use with straight break away headers (SKU : PRT-00116), right angle break away headers (PRT-00553), swiss pins (PRT-00743), machine pins (PRT-00117), and female headers (PRT-00115). Molex polarized connector foot print use with SKU : PRT-08094 with associated crimp pins and housings. NOTES ON THE VARIANTS LOCK and LOCK_LONGPADS... This footprint was designed to help hold the alignment of a through-hole component (i.e. 6-pin header) while soldering it into place. You may notice that each hole has been shifted either up or down by 0.005 of an inch from it's more standard position (which is a perfectly straight line). This slight alteration caused the pins (the squares in the middle) to touch the edges of the holes. Because they are alternating, it causes a "brace" to hold the component in place. 0.005 has proven to be the perfect amount of "off-center" position when using our standard breakaway headers. Although looks a little odd when you look at the bare footprint, once you have a header in there, the alteration is very hard to notice. Also, if you push a header all the way into place, it is covered up entirely on the bottom side. This idea of altering the position of holes to aid alignment will be further integrated into the Sparkfun Library for other footprints. It can help hold any component with 3 or more connection pins.
L1 L2 = wuerth-elektronik:WE-CBF: SMD EMI Suppression Ferrite Beads - excellent anti-EMI properties - low DCR - impedances till 3000 ohms - rated current up to 6 A
LED1 LED2 = led:LED: LED OSRAM: - CHIPLED LG R971, LG N971, LY N971, LG Q971, LY Q971, LO R971, LY R971 LH N974, LH R974 LS Q976, LO Q976, LY Q976 LO Q996 - Hyper CHIPLED LW Q18S LB Q993, LB Q99A, LB R99A - SideLED LS A670, LO A670, LY A670, LG A670, LP A670 LB A673, LV A673, LT A673, LW A673 LH A674 LY A675 LS A676, LA A676, LO A676, LY A676, LW A676 LS A679, LY A679, LG A679 - Hyper Micro SIDELED® LS Y876, LA Y876, LO Y876, LY Y876 LT Y87S - SmartLED LW L88C, LW L88S LB L89C, LB L89S, LG L890 LS L89K, LO L89K, LY L89K LS L896, LA L896, LO L896, LY L896 - TOPLED LS T670, LO T670, LY T670, LG T670, LP T670 LSG T670, LSP T670, LSY T670, LOP T670, LYG T670 LG T671, LOG T671, LSG T671 LB T673, LV T673, LT T673, LW T673 LH T674 LS T676, LA T676, LO T676, LY T676, LB T676, LH T676, LSB T676, LW T676 LB T67C, LV T67C, LT T67C, LS T67K, LO T67K, LY T67K, LW E67C LS E67B, LA E67B, LO E67B, LY E67B, LB E67C, LV E67C, LT E67C LW T67C LS T679, LY T679, LG T679 LS T770, LO T770, LY T770, LG T770, LP T770 LB T773, LV T773, LT T773, LW T773 LH T774 LS E675, LA E675, LY E675, LS T675 LS T776, LA T776, LO T776, LY T776, LB T776 LHGB T686 LT T68C, LB T68C - Hyper Mini TOPLED® LB M676 - Mini TOPLED Santana® LG M470 LS M47K, LO M47K, LY M47K Source: http://www.osram.convergy.de LUXEON: - LUMILED® LXK2-PW12-R00, LXK2-PW12-S00, LXK2-PW14-U00, LXK2-PW14-V00 LXK2-PM12-R00, LXK2-PM12-S00, LXK2-PM14-U00 LXK2-PE12-Q00, LXK2-PE12-R00, LXK2-PE12-S00, LXK2-PE14-T00, LXK2-PE14-U00 LXK2-PB12-K00, LXK2-PB12-L00, LXK2-PB12-M00, LXK2-PB14-N00, LXK2-PB14-P00, LXK2-PB14-Q00 LXK2-PR12-L00, LXK2-PR12-M00, LXK2-PR14-Q00, LXK2-PR14-R00 LXK2-PD12-Q00, LXK2-PD12-R00, LXK2-PD12-S00 LXK2-PH12-R00, LXK2-PH12-S00 LXK2-PL12-P00, LXK2-PL12-Q00, LXK2-PL12-R00 Source: www.luxeon.com KINGBRIGHT: KA-3528ASYC Source: www.kingbright.com
Q1 = crystal:CRYSTAL: CRYSTAL
Q2 = transistor:*-NPN-: NPN Transistror BF959 corrected 2008.03.06
R1 R2 R10-R22 R27-R60 R67-R75 R86-R89 = rcl:R-US_: RESISTOR, American symbol
R3-R9 R23-R26 R61-R66 R76-R85 = og-pots:POT_US
SW1 = og-switch:LP4OA1PBCT
SW2 SW3 = adafruit:EVQQ2: SMT 6mm switch, EVQQ2 series http://www.ladyada.net/library/eagle
TP1 = SparkFun:TEST-POINT